# Altium schematic sheet acquisition.SchDoc
size B; SheetNumber: 1; SheetTotal: 1
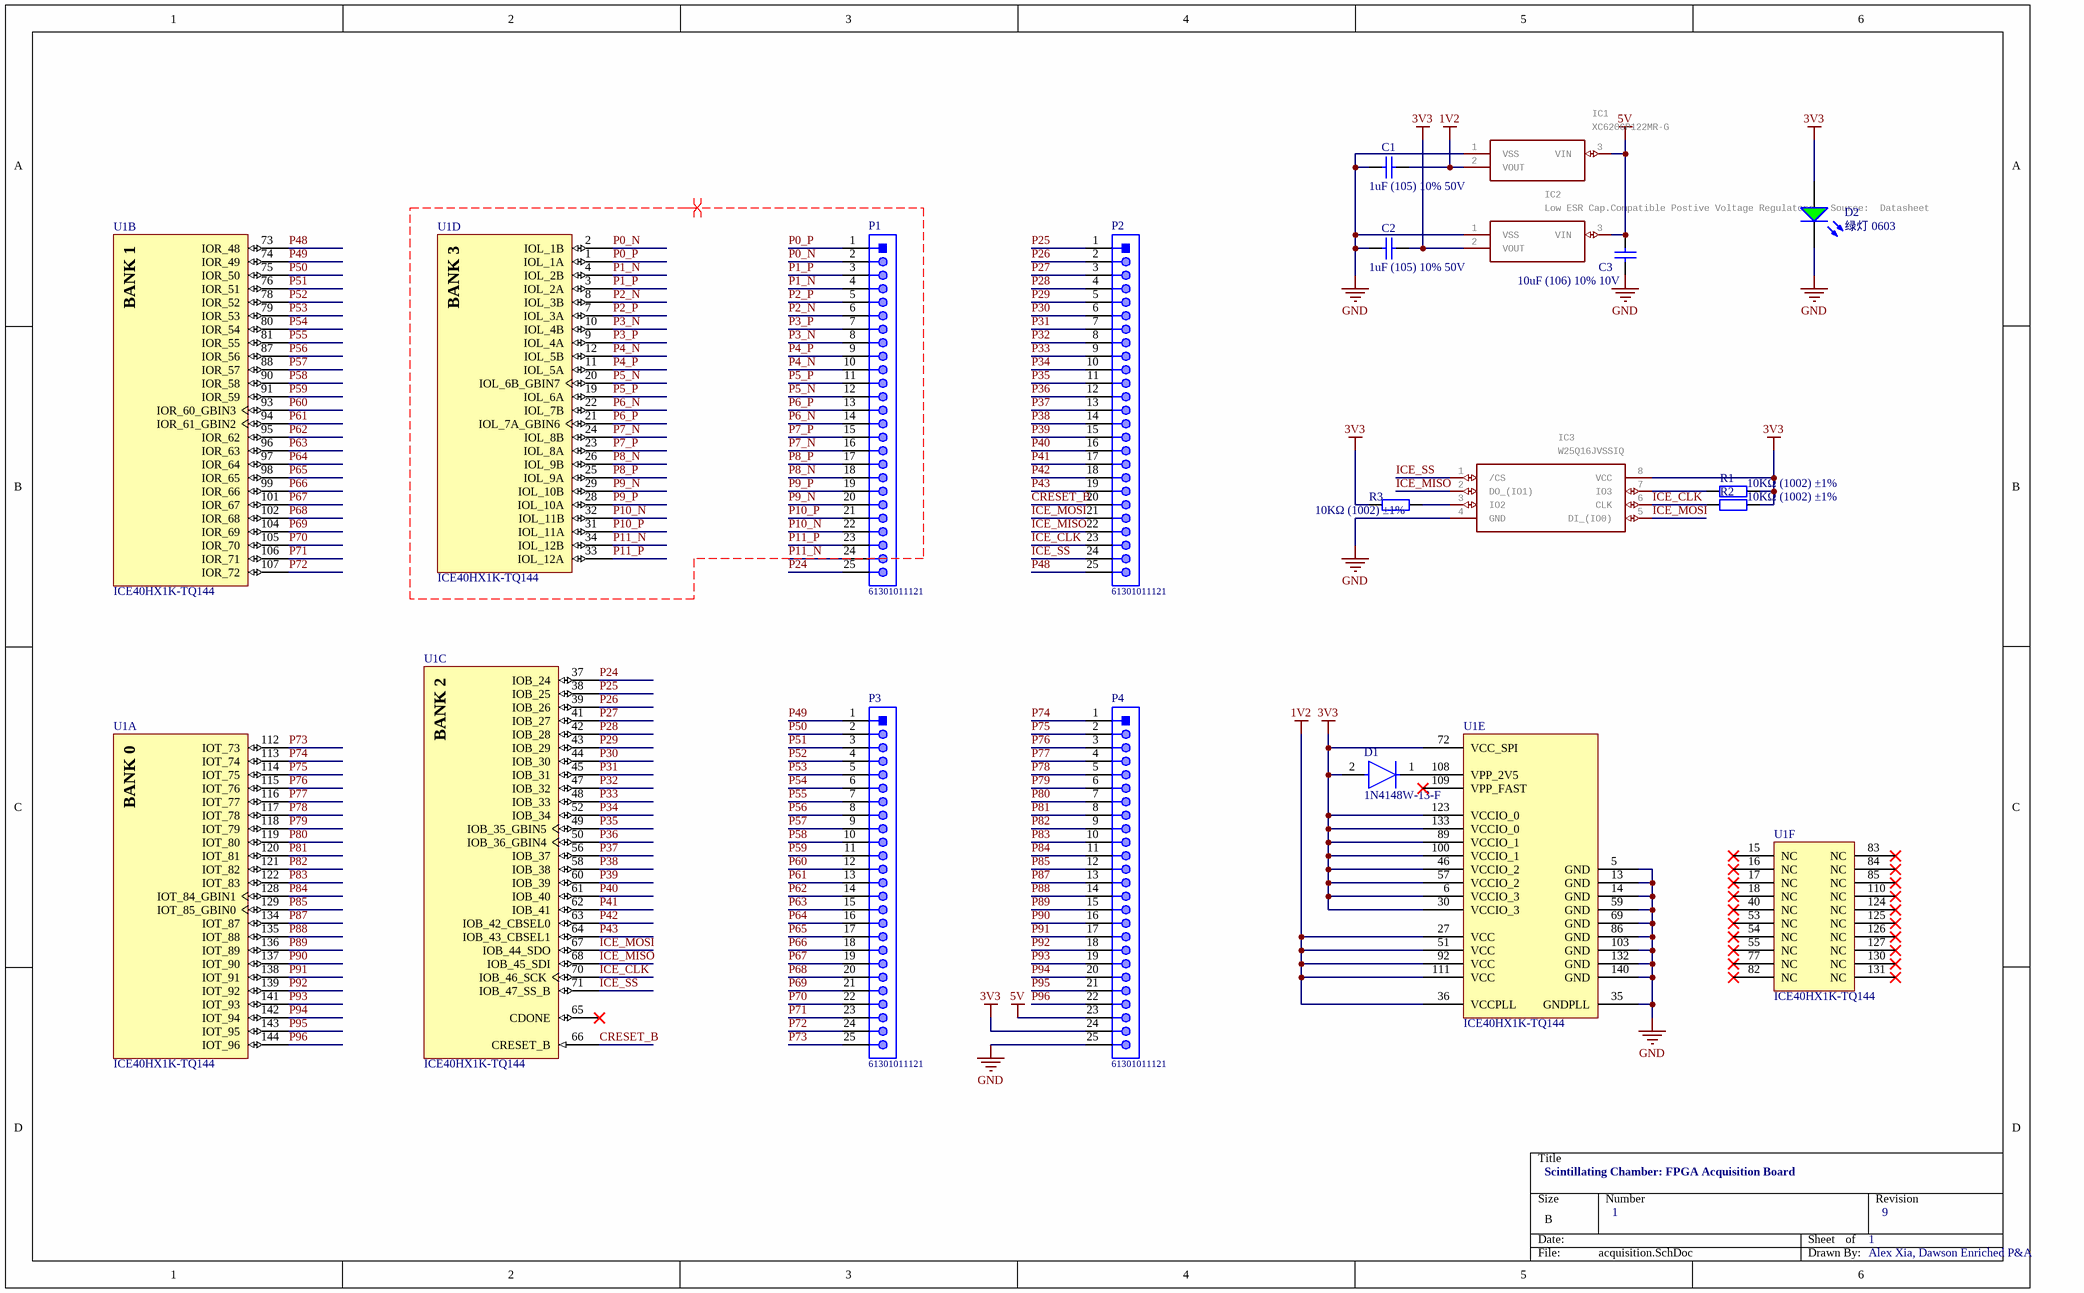
[diagram p0: acquisition.SchDoc]

## Parts
C1  1uF (105) 10% 50V  [0603_C]
C2  1uF (105) 10% 50V  [0603_C]
C3  10uF (106) 10% 10V  [0603_C]
D1  1N4148W-13-F  [FP-SOD123-MFG]
D2  绿灯 0603  [0603_LED_S1]
IC1  XC6206P122MR-G  [SOT95P280X130-3N]
IC2  Low ESR Cap.Compatible Postive Voltage Regulators   Source:  Datasheet  [SOT95P280X130-3N]
IC3  W25Q16JVSSIQ  [SOIC127P790X216-8N]
P1  61301011121  [61301011121]
P2  61301011121  [61301011121]
P3  61301011121  [61301011121]
P4  61301011121  [61301011121]
R1  10KΩ (1002) ±1%  [0603_R]
R2  10KΩ (1002) ±1%  [0603_R]
R3  10KΩ (1002) ±1%  [0603_R]
U1  ICE40HX1K-TQ144  [LATC-TQFP-144_L]  (parts A,B,C,D,E,F of 6)

## Nets
1V2: C1.1 IC1.2(VOUT) U1.27(VCC) U1.36(VCCPLL) U1.51(VCC) U1.92(VCC) U1.111(VCC)
3V3: C2.1 D1.2(A) D2.A IC2.2(VOUT) IC3.8(VCC) P4.24 R1.2 R2.2 R3.1 U1.6(VCCIO_3) U1.30(VCCIO_3) U1.46(VCCIO_2) U1.57(VCCIO_2) U1.72(VCC_SPI) U1.89(VCCIO_1) U1.100(VCCIO_1) U1.123(VCCIO_0) U1.133(VCCIO_0)
5V: C3.1 IC1.3(VIN) IC2.3(VIN) P4.23
GND: C1.2 C2.2 C3.2 D2.K IC1.1(VSS) IC2.1(VSS) IC3.4(GND) P4.25 U1.5(GND) U1.13(GND) U1.14(GND) U1.35(GNDPLL) U1.59(GND) U1.69(GND) U1.86(GND) U1.103(GND) U1.132(GND) U1.140(GND)
CRESET_B: P2.20 U1.66(CRESET_B)
ICE_CLK: IC3.6(CLK) P2.23 R2.1 U1.70(IOB_46_SCK)
ICE_MISO: IC3.2(DO_(IO1)) P2.22 U1.68(IOB_45_SDI)
ICE_MOSI: IC3.5(DI_(IO0)) P2.21 U1.67(IOB_44_SDO)
ICE_SS: IC3.1(/CS) P2.24 U1.71(IOB_47_SS_B)
P0_N: P1.2 U1.2(IOL_1B)
P0_P: P1.1 U1.1(IOL_1A)
P1_N: P1.4 U1.4(IOL_2B)
P1_P: P1.3 U1.3(IOL_2A)
P2_N: P1.6 U1.8(IOL_3B)
P2_P: P1.5 U1.7(IOL_3A)
P3_N: P1.8 U1.10(IOL_4B)
P3_P: P1.7 U1.9(IOL_4A)
P4_N: P1.10 U1.12(IOL_5B)
P4_P: P1.9 U1.11(IOL_5A)
P5_N: P1.12 U1.20(IOL_6B_GBIN7)
P5_P: P1.11 U1.19(IOL_6A)
P6_N: P1.14 U1.22(IOL_7B)
P6_P: P1.13 U1.21(IOL_7A_GBIN6)
P7_N: P1.16 U1.24(IOL_8B)
P7_P: P1.15 U1.23(IOL_8A)
P8_N: P1.18 U1.26(IOL_9B)
P8_P: P1.17 U1.25(IOL_9A)
P9_N: P1.20 U1.29(IOL_10B)
P9_P: P1.19 U1.28(IOL_10A)
P10_N: P1.22 U1.32(IOL_11B)
P10_P: P1.21 U1.31(IOL_11A)
P11_N: P1.24 U1.34(IOL_12B)
P11_P: P1.23 U1.33(IOL_12A)
P24: P1.25 U1.37(IOB_24)
P25: P2.1 U1.38(IOB_25)
P26: P2.2 U1.39(IOB_26)
P27: P2.3 U1.41(IOB_27)
P28: P2.4 U1.42(IOB_28)
P29: P2.5 U1.43(IOB_29)
P30: P2.6 U1.44(IOB_30)
P31: P2.7 U1.45(IOB_31)
P32: P2.8 U1.47(IOB_32)
P33: P2.9 U1.48(IOB_33)
P34: P2.10 U1.52(IOB_34)
P35: P2.11 U1.49(IOB_35_GBIN5)
P36: P2.12 U1.50(IOB_36_GBIN4)
P37: P2.13 U1.56(IOB_37)
P38: P2.14 U1.58(IOB_38)
P39: P2.15 U1.60(IOB_39)
P40: P2.16 U1.61(IOB_40)
P41: P2.17 U1.62(IOB_41)
P42: P2.18 U1.63(IOB_42_CBSEL0)
P43: P2.19 U1.64(IOB_43_CBSEL1)
P48: P2.25 U1.73(IOR_48)
P49: P3.1 U1.74(IOR_49)
P50: P3.2 U1.75(IOR_50)
P51: P3.3 U1.76(IOR_51)
P52: P3.4 U1.78(IOR_52)
P53: P3.5 U1.79(IOR_53)
P54: P3.6 U1.80(IOR_54)
P55: P3.7 U1.81(IOR_55)
P56: P3.8 U1.87(IOR_56)
P57: P3.9 U1.88(IOR_57)
P58: P3.10 U1.90(IOR_58)
P59: P3.11 U1.91(IOR_59)
P60: P3.12 U1.93(IOR_60_GBIN3)
P61: P3.13 U1.94(IOR_61_GBIN2)
P62: P3.14 U1.95(IOR_62)
P63: P3.15 U1.96(IOR_63)
P64: P3.16 U1.97(IOR_64)
P65: P3.17 U1.98(IOR_65)
P66: P3.18 U1.99(IOR_66)
P67: P3.19 U1.101(IOR_67)
P68: P3.20 U1.102(IOR_68)
P69: P3.21 U1.104(IOR_69)
P70: P3.22 U1.105(IOR_70)
P71: P3.23 U1.106(IOR_71)
P72: P3.24 U1.107(IOR_72)
P73: P3.25 U1.112(IOT_73)
P74: P4.1 U1.113(IOT_74)
P75: P4.2 U1.114(IOT_75)
P76: P4.3 U1.115(IOT_76)
P77: P4.4 U1.116(IOT_77)
P78: P4.5 U1.117(IOT_78)
P79: P4.6 U1.118(IOT_79)
P80: P4.7 U1.119(IOT_80)
P81: P4.8 U1.120(IOT_81)
P82: P4.9 U1.121(IOT_82)
P83: P4.10 U1.122(IOT_83)
P84: P4.11 U1.128(IOT_84_GBIN1)
P85: P4.12 U1.129(IOT_85_GBIN0)
P87: P4.13 U1.134(IOT_87)
P88: P4.14 U1.135(IOT_88)
P89: P4.15 U1.136(IOT_89)
P90: P4.16 U1.137(IOT_90)
P91: P4.17 U1.138(IOT_91)
P92: P4.18 U1.139(IOT_92)
P93: P4.19 U1.141(IOT_93)
P94: P4.20 U1.142(IOT_94)
P95: P4.21 U1.143(IOT_95)
P96: P4.22 U1.144(IOT_96)
NetD1_1: D1.1(C) U1.108(VPP_2V5)
NetIC3_3: IC3.3(IO2) R3.2
NetIC3_7: IC3.7(IO3) R1.1

Not connected (* = marked no-connect by the designer): U1 15(NC)* 16(NC)* 17(NC)* 18(NC)* 40(NC)* 53(NC)* 54(NC)* 55(NC)* 65(CDONE)* 77(NC)* 82(NC)* 83(NC)* 84(NC)* 85(NC)* 109(VPP_FAST)* 110(NC)* 124(NC)* 125(NC)* 126(NC)* 127(NC)* 130(NC)* 131(NC)*

## Layout directives
differential pair: P0_N, P0_P, P1_N, P1_P, P2_N, P2_P, P3_N, P3_P, P4_N, P4_P, P5_N, P5_P, P6_N, P6_P, P7_N, P7_P, P8_N, P8_P, P9_N, P9_P, P10_N, P10_P, P11_N, P11_P

## Notes on the sheet
- Scintillating Chamber: FPGA Acquisition Board
- 1
- 9
- Alex Xia, Dawson Enriched P&A
- (in symbol CMP-0962-00009-1, part A) BANK 0
- (in symbol CMP-0962-00009-1, part B) BANK 1
- (in symbol CMP-0962-00009-1, part C) BANK 2
- (in symbol CMP-0962-00009-1, part D) BANK 3

## Library data of the parts
C1 C2 = 0603 1uF (105) 10% 50V: 贴片电容; ComponentLink1Description: 供应商链接; ComponentLink1URL: http://www.szlcsc.com/product/details_16531.html; Package: 0603; Supplier: LC; SuppliersPartNumber: C15849
C3 = 0603 10uF (106) 10% 10V: 贴片电容; ComponentLink1Description: 供应商链接; ComponentLink1URL: http://www.szlcsc.com/product/details_20411.html; Package: 0603; Supplier: LC; SuppliersPartNumber: C19702
D1 = CMP-12791-000005-1: DIODE GEN PURP 100V 150MA SOD123; Manufacturer: Diodes Inc.; Capacitance: 2pF; Forward Current: 300mA; Max Junction Temp: +150°C; Value: 2pF; Standoff Height: 0mm; Peak Reverse Current: 1uA; Max Surge Forward Current: 1A; Category: Diode; Height: 1.45mm; ComponentLink2URL: https://upverter.com/datasheet/628e7d6fee5901eee6eef4567d1c3569f2cd3cde.pdf; Lead Free: Yes; ComponentLink2Description: Datasheet; Octopart: https://octopart.com/1n4148w-13-f-diodes+inc.-2359612; Temperature Range High: +150°C; Device Class L2: Diodes; Digikey Description: DIODE GEN PURP 100V 150MA SOD123; Reverse Voltage: 100V; Temperature Range Low: -65°C; Device Class L1: Discrete Semiconductors; Package: SOD123; RoHS: TRUE; Manufacturer Part Number: 1N4148W-13-F; Footprint Url: https://www.diodes.com/assets/Package-Files/SOD123.pdf; Automotive: No; Max Repetitive Reverse Voltage: 100V; Mouser Description: 1N4148W Series 2 A 100 V 400 mW Surface Mount Fast Switching Diode - SOD-123; Temperature: -65°C to +150°C; Device Class L3: Rectifier Diodes
D2 = 0603 绿灯: 发光二极管; ComponentLink1Description: 供应商链接; ComponentLink1URL: http://www.szlcsc.com/product/details_73152.html; Package: 0603; Supplier: LC; SuppliersPartNumber: C72043
IC1 = XC6206P122MR-G: Manufacturer_Name: Torex; GateName_1: G$1; SymbolName_1: XC6206P122MR-G; LibraryName: XC6206P122MR-G; DeviceSetName: XC6206P122MR-G; Package: SOT95P280X130-3N; Manufacturer_Part_Number: XC6206P122MR-G; Mouser_Part_Number: 865-XC6206P122MR-G; Mouser_Price-Stock: https://www.mouser.co.uk/ProductDetail/Torex-Semiconductor/XC6206P122MR-G?qs=AsjdqWjXhJ%2F35%2FU%2FZk2JYg%3D%3D; Height: 1.3mm
IC2 = XC6206P332MR: Manufacturer_Name: Torex; GateName_1: G$1; SymbolName_1: XC6206P332MR; LibraryName: XC6206P332MR; DeviceSetName: XC6206P332MR; Package: SOT95P280X130-3N; Manufacturer_Part_Number: XC6206P332MR; Height: 1.3mm
IC3 = W25Q16JVSSIQ: Manufacturer_Name: Winbond; GateName_1: G$1; SymbolName_1: W25Q16JVSSIQ; LibraryName: W25Q16JVSSIQ; DeviceSetName: W25Q16JVSSIQ; Package: SOIC127P790X216-8N; Manufacturer_Part_Number: W25Q16JVSSIQ; Mouser_Part_Number: 454-W25Q16JVSSIQ; Mouser_Price-Stock: https://www.mouser.co.uk/ProductDetail/Winbond/W25Q16JVSSIQ?qs=qSfuJ%252Bfl%2Fd46L%2F1QrQC%2Fog%3D%3D; Arrow_Part_Number: W25Q16JVSSIQ; Arrow_Price-Stock: https://www.arrow.com/en/products/w25q16jvssiq/winbond-electronics; Height: 2.16mm
P1-P4 = header: THT Vertical Pin Header WR-PHD, Pitch 2.54 mm, Single Row, 25 pins
R1-R3 = 0603 10KΩ (1002) 1%: 贴片电阻; ComponentLink1Description: 供应商链接; ComponentLink1URL: http://www.szlcsc.com/product/details_26547.html; Package: 0603; Supplier: LC; SuppliersPartNumber: C25804
U1 = CMP-0962-00009-1: iCE40 HX1K Series FPGA Family, 1280 Logic Cells, 1.2 V Core, 64 K Embedded RAM Bits, 144-pin TQFP, Pb-Free, Tray; Manufacturer: Lattice Semiconductor; Embedded RAM Bits: 64K; Logic Cells: 1280; Phase-Locked Loops: 1; Supply Voltage: 1.2V; Mounting Technology: Surface Mount; ComponentLink3URL: http://www.latticesemi.com/lit/docs/package/pkg.pdf; ComponentLink1URL: http://www.latticesemi.com/en; ComponentLink2Description: Datasheet; RoHS: TRUE; ComponentLink2URL: http://www.latticesemi.com/~/media/Documents/DataSheets/iCE/iCE40LPHXFamilyDataSheet.pdf; PackageVersion: Rev. 03.9, 02/2013; ComponentLink1Description: Manufacturer URL; PartNumber: ICE40HX1K-TQ144; DatasheetVersion: Rev. 02.9; PackageReference: TQFP-144; PackageDescription: 144-Pin Thin Quad Flat Package, Body 20 x 20 mm, Pitch 0.5 mm; Packing: Tray; ComponentLink3Description: Package Specification